# EAGLE design Adafruit HUZZAH32 ESP32 Feather (EAGLE 9.5.0)
COMPANY: ADAFRUIT INDUSTRIES; DRAWN: KTOWN; REV: B
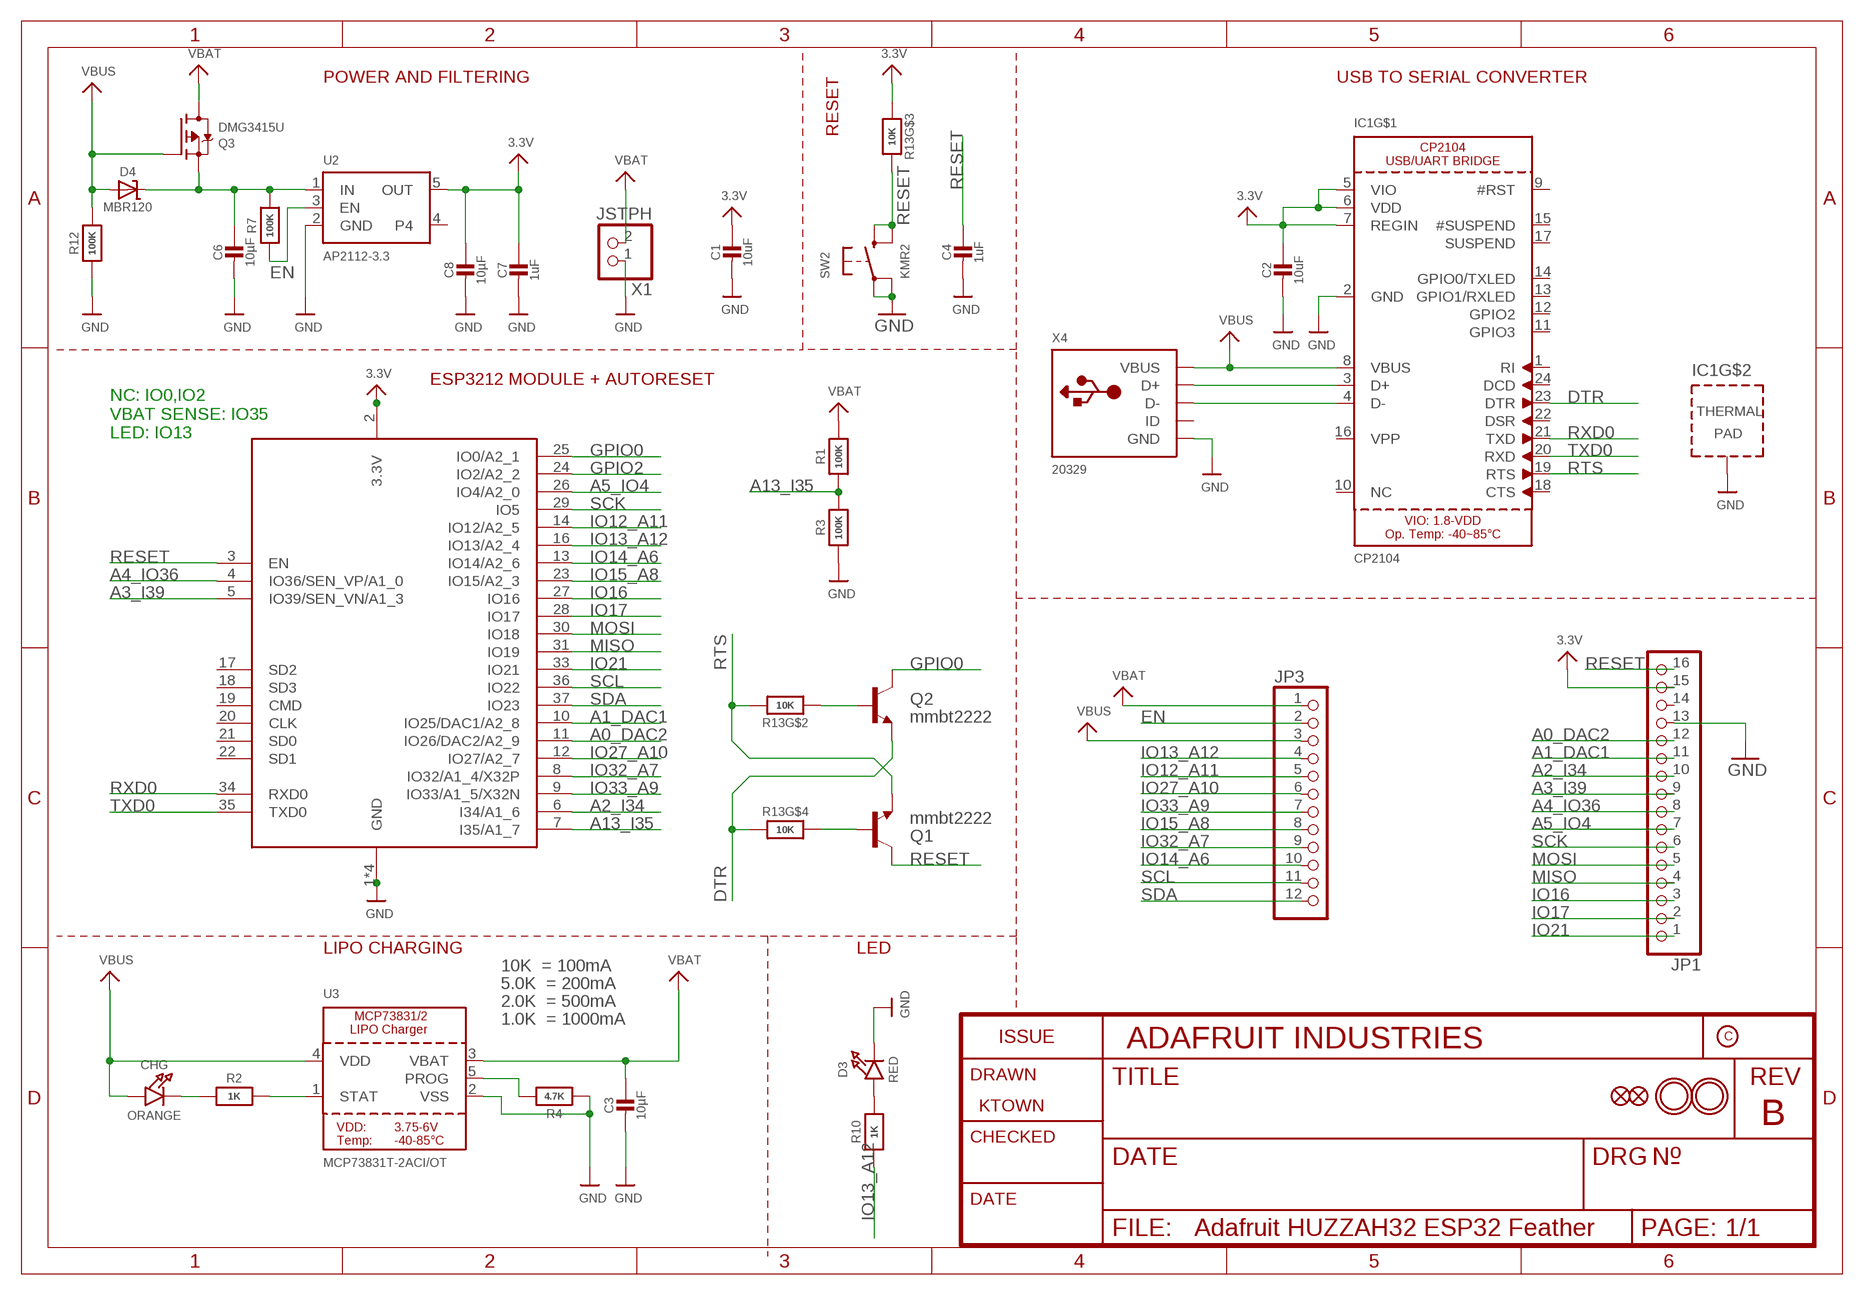
[diagram p0: schematic, sheet 1]

## Parts
C1  10uF  CAP_CERAMIC0805-NOOUTLINE  [0805-NO]
C2  10uF  CAP_CERAMIC0805-NOOUTLINE  [0805-NO]
C3  10µF  CAP_CERAMIC0805-NOOUTLINE  [0805-NO]
C4  1uF  CAP_CERAMIC0603_NO  [0603-NO]
C6  10µF  CAP_CERAMIC0805-NOOUTLINE  [0805-NO]
C7  1uF  CAP_CERAMIC0603_NO  [0603-NO]
C8  10µF  CAP_CERAMIC0805-NOOUTLINE  [0805-NO]
CHG  ORANGE  LED0805_NOOUTLINE  [CHIPLED_0805_NOOUTLINE]
D3  RED  LED0805_NOOUTLINE  [CHIPLED_0805_NOOUTLINE]
D4  MBR120  DIODE-SCHOTTKYSOD-123  [SOD-123]
IC1  CP2104  [QFN24_4MM_SMSC]
JP1  HEADER-1X16_MIN  [1X16_ROUND_MIN]
JP3  HEADER-1X12_MIN  [1X12_ROUND_MIN]
Q1  mmbt2222  TRANSISTOR_NPNSOT23-3  [SOT23-3]
Q2  mmbt2222  TRANSISTOR_NPNSOT23-3  [SOT23-3]
Q3  DMG3415U  MOSFET-P  [SOT23-R]
R1  100K  RESISTOR_0603_NOOUT  [0603-NO]
R2  1K  RESISTOR_0603_NOOUT  [0603-NO]
R3  100K  RESISTOR_0603_NOOUT  [0603-NO]
R4  4.7K  RESISTOR_0603_NOOUT  [0603-NO]
R7  100K  RESISTOR_0603_NOOUT  [0603-NO]
R10  1K  RESISTOR_0603_NOOUT  [0603-NO]
R12  100K  RESISTOR_0603_NOOUT  [0603-NO]
R13  10K  RESISTOR_4PACK  [RESPACK_4X0603]
SW2  KMR2  SWITCH_TACT_SMT4.6X2.8  [BTN_KMR2_4.6X2.8]
U2  AP2112-3.3  VREG_SOT23-5  [SOT23-5]
U3  MCP73831T-2ACI/OT  MCP73831/2  [SOT23-5]
U$31  MOUNTINGHOLE2.5  [MOUNTINGHOLE_2.5_PLATED]
U$32  MOUNTINGHOLE2.5  [MOUNTINGHOLE_2.5_PLATED]
U$34  FIDUCIAL_1MM  [FIDUCIAL_1MM]
U$35  FIDUCIAL_1MM  [FIDUCIAL_1MM]
X1  JSTPH  CON_JST_PH_2PIN  [JSTPH2]
X2  ESP32_WROOM32_SKINNY  [WROOM32_SKINNY]
X4  20329  USB_MICRO_20329_V2  [4UCONN_20329_V2]

## Nets
3.3V: C1.1 C2.1 C7.1 C8.1 IC1.5(VIO) IC1.6(VDD) IC1.7(REGIN) JP1.15 R13.3 U2.5(OUT) X2.2(3.3V)
A0_DAC2: JP1.12 X2.11(IO26/DAC2/A2_9)
A1_DAC1: JP1.11 X2.10(IO25/DAC1/A2_8)
A2_I34: JP1.10 X2.6(I34/A1_6)
A3_I39: JP1.9 X2.5(IO39/SEN_VN/A1_3)
A4_IO36: JP1.8 X2.4(IO36/SEN_VP/A1_0)
A5_IO4: JP1.7 X2.26(IO4/A2_0)
A13_I35: R1.1 R3.2 X2.7(I35/A1_7)
DTR: IC1.23(DTR) Q2.2(E) R13.4
EN: JP3.2 R7.1 U2.3(EN)
GND: C1.2 C2.2 C3.2 C4.2 C6.2 C7.2 C8.2 D3.C IC1.2(GND) IC1.THERM(TP) JP1.13 R3.1 R4.1 R12.1 SW2.A'(P1) SW2.A(P) U2.2(GND) U3.2(VSS) X1.1 X2.1(GND) X2.15(GND) X2.38(GND) X2.P$1(GND) X4.BASE@1(GND) X4.BASE@2(GND) X4.GND X4.SPRT@1(GND) X4.SPRT@2(GND) X4.SPRT@3(GND) X4.SPRT@4(GND)
GPIO0: Q2.3(C) X2.25(IO0/A2_1)
GPIO2: X2.24(IO2/A2_2)
IO12_A11: JP3.5 X2.14(IO12/A2_5)
IO13_A12: JP3.4 R10.1 X2.16(IO13/A2_4)
IO14_A6: JP3.10 X2.13(IO14/A2_6)
IO15_A8: JP3.8 X2.23(IO15/A2_3)
IO16: JP1.3 X2.27(IO16)
IO17: JP1.2 X2.28(IO17)
IO21: JP1.1 X2.33(IO21)
IO27_A10: JP3.6 X2.12(IO27/A2_7)
IO32_A7: JP3.9 X2.8(IO32/A1_4/X32P)
IO33_A9: JP3.7 X2.9(IO33/A1_5/X32N)
MISO: JP1.4 X2.31(IO19)
MOSI: JP1.5 X2.30(IO18)
N$1: CHG.C R2.1
N$2: IC1.3(D+) X4.D+
N$3: R2.2 U3.1(STAT)
N$4: R4.2 U3.5(PROG)
N$5: D3.A R10.2
N$6: IC1.4(D-) X4.D-
N$7: C6.1 D4.C Q3.2(S) R7.2 U2.1(IN)
N$12: Q1.1(B) R13.5
N$13: Q2.1(B) R13.2
RESET: C4.1 JP1.16 Q1.3(C) R13.6 SW2.B'(S1) SW2.B(S) X2.3(EN)
RTS: IC1.19(RTS) Q1.2(E) R13.7
RXD0: IC1.21(TXD) X2.34(RXD0)
SCK: JP1.6 X2.29(IO5)
SCL: JP3.11 X2.36(IO22)
SDA: JP3.12 X2.37(IO23)
TXD0: IC1.20(RXD) X2.35(TXD0)
VBAT: C3.1 JP3.1 Q3.3(D) R1.2 U3.3(VBAT) X1.2
VBUS: CHG.A D4.A IC1.8(VBUS) JP3.3 Q3.1(G) R12.2 U3.4(VDD) X4.VBUS
Unconnected: IC1.1(RI) IC1.9(#RST) IC1.10(NC) IC1.11(GPIO3) IC1.12(GPIO2) IC1.13(GPIO1/RXLED) IC1.14(GPIO0/TXLED) IC1.15(#SUSPEND) IC1.16(VPP) IC1.17(SUSPEND) IC1.18(CTS) IC1.22(DSR) IC1.24(DCD) JP1.14 R13.1 R13.8 U2.4 X2.17(SD2) X2.18(SD3) X2.19(CMD) X2.20(CLK) X2.21(SD0) X2.22(SD1) X4.ID

## Notes on the sheet
- POWER AND FILTERING | USB TO SERIAL CONVERTER
- RESET
- ESP3212 MODULE + AUTORESET
- NC: IO0,IO2
  VBAT SENSE: IO35
  LED: IO13
- LIPO CHARGING | LED
- 10K  = 100mA
- 5.0K  = 200mA
- 2.0K  = 500mA
- 1.0K  = 1000mA

## Library data of the parts
C1-C4 C6-C8 = microbuilder:CAP_CERAMIC: Ceramic Capacitors For new designs, use the packages preceded by an '_' character since they are more reliable: The following footprints should be used on most boards: _0402 - Standard footprint for regular board layouts _0603 - Standard footprint for regular board layouts _0805 - Standard footprint for regular board layouts _1206 - Standard footprint for regular board layouts For extremely tight-pitch boards where space is at a premium, the following 'micro-pitch' footprints can be used (smaller pads, no silkscreen outline, etc.): _0402MP - Micro-pitch footprint for very dense/compact boards _0603MP - Micro-pitch footprint for very dense/compact boards _0805MP - Micro-pitch footprint for very dense/compact boards _1206MP - Micro-pitch footprint for very dense/compact boards
CHG D3 = microbuilder:LED: LED 0603 - 0603 Surface Mount Package 2mA: Green LED - Low Power (3.9mcd, 2ma, 1.7Vf) - Digikey: 475-2709-2-ND Orange LED - Low Power (9.8mcd, 2ma, 1.8Vf) - Digikey: 475-1194-2-ND Red LED - Low Power (5mcd, 2ma, 1.8Vf) - Digikey: 475-1195-2-ND Yellow LED - Low Power (7mcd, 2ma, 1.8Vf) - Digikey: 475-1196-2-ND 5mA: Blue LED - Low Power (17mcd, 5ma, 2.9Vf) - Digikey: LNJ937W8CRACT-ND 0805 - 0805 Surface Mount Package 2mA: Red LED (8.8mcd, 2mA, 1.8Vf, Clear) - Low Power [Digikey: 475-2510-1-ND] Green LED (5mcd, 2mA, 1.8Vf, Clear) - Low Power [Digikey: 475-2730-1-ND] Yellow LED (11.3mcd, 2mA, 1.8Vf, Clear) - Low Power [Digikey: 475-2555-1-ND] 20mA: Red LED (104mcd, 20mA, Diffused) - LS R976 [Digikey: 475-1278-6-ND] Red LED (12mcd, 20mA, 2.0Vf, Clear) - APT2012EC [Digikey: 754-1128-1-ND] Green LED (15mcd, 20mA, 2.2Vf, Clear) - APT2012GC [Digikey: 754-1131-1-ND] Orange LED (160mcd, 20mA, 2.1Vf, Clear) - APT2012SECK [Digikey: 754-1130-1-ND] 1206 - 1206 Surface Mount Package Green LED (26mcd, 20mA, Diffused) - LG N971 [Digikey: 475-1407-6-ND] Red LED (15mcd, 20mA, Diffused) - LH N974 [Digikey: 475-1416-6-ND] Cree - Cree High-Power Surface Mount LEDs XPEBWT-L1-0000-00D50 - White 111lm 350mA 2.9Vf 6200K 110° XTEAWT-00-0000-00000LEE3 - White 114lm 350mA 2.85Vf 5000K 115° Everlight - Everlight 45-21 Series Surface Mount LEDs 45-21/QK2C-B2832AC2CB2/2T - Warm White 2000mcd 20mA 3.25Vf 3050K 120° 45-21/LK2C-B38452C4CB2/2T - Nuetral White 2000mcd 20mA 3.25Vf 4150K 120° 45-21/LK2C-B50634C6CB2/2T - Cold White 2200mcd 20mA 3.25Vf 5650K 120° PLCC2 Reverse Mount LS T77K-J1L2-1-0-2-R18-Z - Red 11.25mcd 2mA 1.8Vf 630nm 120° LO T77K-L1M2-24-Z - Orange 19.6mcd 2mA 1.8Vf 606nm 120° LY T77K-K2M1-26-Z - Yellow 15.7mcd 2mA 1.8Vf 587nm 120°
D4 = microbuilder:DIODE-SCHOTTKY
IC1 = microbuilder:CP2104: CP2104 - USB to UART Bridge VDD Output: 3.45V
JP1 = microbuilder:HEADER-1X16: PIN HEADER
JP3 = microbuilder:HEADER-1X12
Q1 Q2 = SparkFun:TRANSISTOR_NPN: Transistor NPN BJT configuration in SOT23 package. MMBT2222 is the common NPN we use. Double check BCE configuration again layout.
Q3 = microbuilder:MOSFET-P: P-Channel Mosfet LEGEND VDS: Voltage Drain-Source ID: Drain Current RDS(ON): Drain-Source On-State Resistance VGS(TH): Gate-Source Threshold Voltage CISS: Drain-Source Input Capacitance SOT-23 Name VDS ID RDS(ON) VGS(TH) CISS Order Number IRLML5103 30V 760mA 600 mOhm -- 75pF @ 25V Digikey: IRLML5103PBFCT-ND IRLML6401 12V 4.3A 50 mOhm 950mV @ 250µA 830pF @ 10V Digikey: IRLML6401PBFTR-ND NTR0202PL 20V 400mA 800 mOhm 2.3V @ 250uA 70pF @ 5V Digikey: NTR0202PLT1GOSTR-ND NTR4101PT1G 20V 1.8A 85 mOhm 1.2V @ 250uA 675pF @ 10V Digikey: NTR4101PT1GOSCT-ND DMP2004K 20V 600mA 900 mOhm 1V @ 250uA 175pF @ 16V Digikey: DMP2004KDICT-ND PMV65XP 20V 3.9A 76 mOhm 950mV @ 1mA 725pF @ 20V Digikey: 568-2358-2-ND TO-252 Name VDS ID RDS(ON) VGS(TH) CISS Order Number AOD417 30V 25A 34 mOhm 3V @ 250µA 920pF @ 15V Digikey: 785-1106-2-ND PowerPak Name VDS ID RDS(ON) VGS(TH) CISS Order Number AON7401 30V 12A 14 mOhm 3V @ 250µA 2600pF @ 15V Digikey: 785-1302-1-ND
R1-R4 R7 R10 R12 = microbuilder:RESISTOR: Resistors For new designs, use the packages preceded by an '_' character since they are more reliable: The following footprints should be used on most boards: _0402 - Standard footprint for regular board layouts _0603 - Standard footprint for regular board layouts _0805 - Standard footprint for regular board layouts _1206 - Standard footprint for regular board layouts For extremely tight-pitch boards where space is at a premium, the following 'micro-pitch' footprints can be used (smaller pads, no silkscreen outline, etc.): _0402MP - Micro-pitch footprint for very dense/compact boards _0603MP - Micro-pitch footprint for very dense/compact boards _0805MP - Micro-pitch footprint for very dense/compact boards _1206MP - Micro-pitch footprint for very dense/compact boards
R13 = microbuilder:RESISTOR_4PACK: Resistor Packs (4 resistors) 4 x 0603 10K 1/16W - Digikey: YC164J-10KCT-ND
SW2 = microbuilder:SWITCH_TACT_SMT: SMT Tact Switches 6x6mm - Digikey: P12940SCT-ND KMR2 (4.6x2.8mm) - Digikey: 401-1426-1-ND EVQ-PQHB55 - Light Touch, 160GF (4.5x4.5mm) - Digikey: P8090SCT-ND KMT0 - KMT021 NGJ LHS (etc.) IP68/Waterproof - Digikey: CKN10289CT-ND
U2 = microbuilder:VREG_SOT23-5: SOT23-5 Fixed Voltage Regulators Part Current Out V Out V In V Dropout θJA (°C/W) TJ (°C) Digikey Part No. ADP121 150mA 3.3V 3.4-5.5V 0.09V @ 150mA -- -- ADP121-AUJZ33R7CT-ND ADP121 150mA 3.0V 3.1-5.5V 0.09V @ 150mA -- -- ADP121-AUJZ30R7CT-ND ADP122 300mA 3.3V 3.4-5.5V 0.085V @ 300mA -- -- ADP122AUJZ-3.3-R7CT-ND ADP1712 300mA 3.3V 3.5-5.5V 0.17V @ 300mA -- -- ADP1712AUJZ-3.3-R7TR-ND AP7311 (Low Cost) 150mA 3.3V 3.5-6V 0.15V @ 150mA -- -- AP7311-33WG-7DICT-ND LD39015M18R 150mA 1.8V 1.9V-5.5V 0.08V @ 100mA -- -- 497-6977-1-ND LP2985A-33DBVR 150mA 3.3V 3.3-16V 0.28V @ 150mA 206 150 296-18479-1-ND MCP1824T-3302E/OT 300mA 3.3V 3.5V-6V 0.2V @ 300mA -- -- MCP1824T-3302E/OTCT-ND MIC5205-2.5YM5 TR 150mA 2.5V 2.7-16V 0.165V @ 150mA -- -- 576-1257-2-ND MIC5205-3.0YM5 TR 150mA 3.0V 3.2V-16V 0.165V @ 150mA -- -- 576-1258-2-ND MIC5205-3.3YM5 TR 150mA 3.3V 3.5V-16V 0.165V @ 150mA -- -- 576-1259-2-ND TPS780330220 150mA 3.3V+2.2V 3.6-5.5V 250mV Max -- -- 296-23332-1-ND TDA3663/N1,135 100mA 3.3V 3.5-45V 0.18V @ 50mA -- -- 568-5343-1-ND Max operating temp can be calculated using θJA, TJ (max junction temperature), and power in watts. Set the "Maximum Ambient Temperature" until it reaches TJ ("Max Junction Temperature"), which is the absolute limit for safe use of the regulator: Heat Sink Temperature Calculator <http://www.daycounter.com/Calculators/Heat-Sink-Temperature-Calculator.phtml> For example, With 12V source into a 3.3V LP2985 and a 30mA load, we are dissipating (12V-3.3V) * 0.03A = 0.261W. With a θJA of 206 °C/W, a TJ of 150°C, and 261mW we can safely use the chip without a heat sink up to 75°C (=147.1°C Junction Temperature).
U3 = microbuilder:MCP73831/2: MCP73831/2 LIPO Charger VDD: 3.75 - 6V Temp -40 - 85°C Programmable Charge Rate: 15-500mA NOTE: STAT is a tri-state logic output on the MCP73831 and an open-drain output on the MCP73832. SOT23-5 with 4.2V output and tri-state logic on STAT = MCP73831T-2ACI/OT
U$31 U$32 = microbuilder:MOUNTINGHOLE: Mounting Hole For #2 screws (0.086"/2.18mm width, 0.094"/2.4mm hole) use 2.5mm; BOM: EXCLUDE
U$34 U$35 = microbuilder:FIDUCIAL: Fiducial Alignment Points Various fiducial points for machine vision alignment.; BOM: EXCLUDE
X1 = microbuilder:CON_JST_PH_2PIN: JST 2-Pin Right-Angle Connector PH-Series - 4UConnector: 17311 SH-Series - 4UConnector: 07278
X2 = microbuilder:ESP32_WROOM32
X4 = microbuilder:USB: USB Connectors USBMINIB - Surface Mount Female Mini-B USB Connector 4UConnector: 06564

## Board
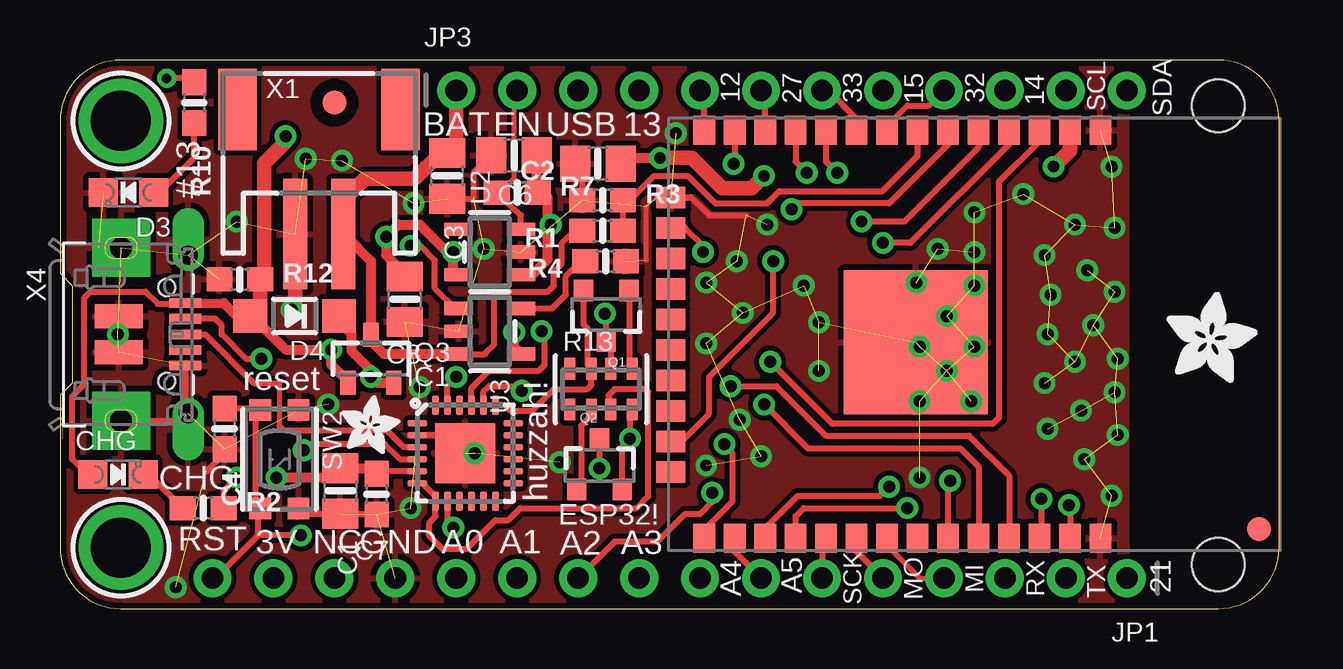
[diagram p1: board, top side]
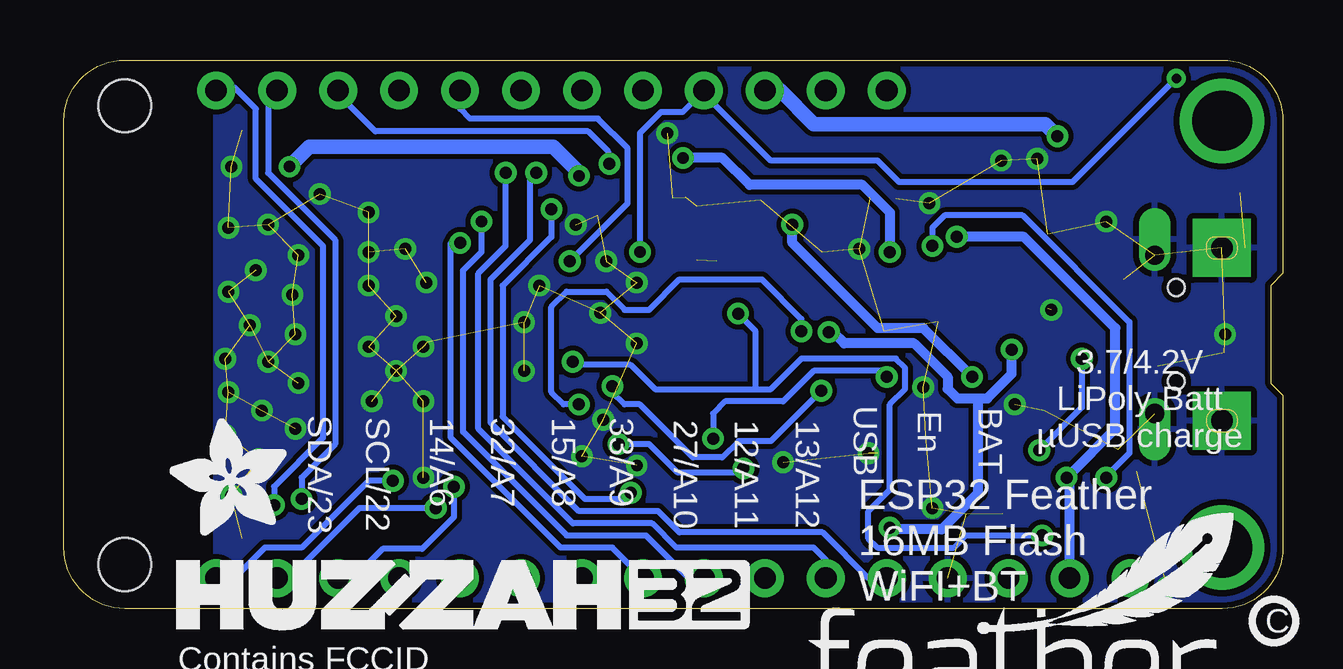
[diagram p2: board, bottom side, seen from below]

Size 50.8 x 22.86 mm. Coordinates in mm from the lower left corner, seen from the top.
Outline: 2.54,0 48.26,0 arc90 50.8,2.54 50.8,20.32 arc90 48.26,22.86 2.54,22.86 arc90 0,20.32 0,13.97 0.51,13.46 0.51,9.4 0,8.89 0,2.54 arc90 2.54,0
Copper layers (1*16): Top 0.035mm / dielectric 1.5mm / Bottom 0.035mm
Design rules "adafruit 7-7 *": minimum track width 6mil, minimum drill 15.5mil, track to track 8mil, track to pad 7mil, pad to pad 7mil, via to via 7mil, smd to smd 7mil, copper to edge 10mil, drill to drill 8mil, minimum pad ring 10mil, minimum via ring 8mil, stop-mask expansion 2mil, vias tented up to drill 20mil, thermal gap 10mil
Holes 2.2 mm at 48.26,1.84 48.26,20.95

### Footprints (pad centres in the part's own frame; a part is rotated, then mirrored left to right if it is on the bottom)
0805-NO = smd 1.24 x 1.5: 1 -0.95,0; 2 0.95,0
0603-NO = smd 1.075 x 1: 1 -0.85,0; 2 0.85,0
CHIPLED_0805_NOOUTLINE = smd 1.2 x 1.2: A 0,-1.05; C 0,1.05
SOD-123 = smd 1.4 x 1.4: A 1.85,0; C -1.85,0
QFN24_4MM_SMSC = smd 0.8 x 0.28: 1 -2,1.25; 2 -2,0.75; 3 -2,0.25; 4 -2,-0.25; 5 -2,-0.75; 6 -2,-1.25; 13 2,-1.25; 14 2,-0.75; 15 2,-0.25; 16 2,0.25; 17 2,0.75; 18 2,1.25 | smd 0.28 x 0.8: 7 -1.25,-2; 8 -0.75,-2; 9 -0.25,-2; 10 0.25,-2; 11 0.75,-2; 12 1.25,-2; 19 1.25,2; 20 0.75,2; 21 0.25,2; 22 -0.25,2; 23 -0.75,2; 24 -1.25,2 | smd 2.5 x 2.5: THERM 0,0
1X16_ROUND_MIN = drill 0.9 pad 1.575: 1 -19.05,0; 2 -16.51,0; 3 -13.97,0; 4 -11.43,0; 5 -8.89,0; 6 -6.35,0; 7 -3.81,0; 8 -1.27,0; 9 1.27,0; 10 3.81,0; 11 6.35,0; 12 8.89,0; 13 11.43,0; 14 13.97,0; 15 16.51,0; 16 19.05,0
1X12_ROUND_MIN = drill 0.9 pad 1.575: 1 -13.97,0; 2 -11.43,0; 3 -8.89,0; 4 -6.35,0; 5 -3.81,0; 6 -1.27,0; 7 1.27,0; 8 3.81,0; 9 6.35,0; 10 8.89,0; 11 11.43,0; 12 13.97,0
SOT23-3 = smd 0.8 x 0.9: 1 -0.95,-1; 2 0.95,-1; 3 0,1.1
SOT23-R = smd 0.635 x 1.016: 1 -0.95,-1; 2 0.95,-1; 3 0,1
RESPACK_4X0603 = smd 0.45 x 0.9: 1 -1.3,-0.85; 2 -0.4,-0.85; 3 0.4,-0.85; 4 1.3,-0.85; 5 1.3,0.85; 6 0.4,0.85; 7 -0.4,0.85; 8 -1.3,0.85
BTN_KMR2_4.6X2.8 = smd 0.9 x 0.9: A 2.05,0.8; A' -2.05,0.8; B 2.05,-0.8; B' -2.05,-0.8
SOT23-5 = smd 0.55 x 1.2: 1 -0.95,-1.3; 2 0,-1.3; 3 0.95,-1.3; 4 0.95,1.3; 5 -0.95,1.3
MOUNTINGHOLE_2.5_PLATED = drill 2.5 pad 3.2: P$1 0,0
FIDUCIAL_1MM = smd 1 x 1: 1 0,0
JSTPH2 = smd 1 x 4.6: 1 -1,-3.7; 2 1,-3.7 | smd 1.6 x 3.4: NC1 -3.4,1.5; NC2 3.4,1.5
WROOM32_SKINNY = smd 1.2 x 0.9: 1 -8.5,5; 2 -8.5,3.73; 3 -8.5,2.46; 4 -8.5,1.19; 5 -8.5,-0.08; 6 -8.5,-1.35; 7 -8.5,-2.62; 8 -8.5,-3.89; 9 -8.5,-5.16; 10 -8.5,-6.43; 11 -8.5,-7.7; 12 -8.5,-8.97; 13 -8.5,-10.24; 14 -8.5,-11.51; 25 8.5,-11.51; 26 8.5,-10.24; 27 8.5,-8.97; 28 8.5,-7.7; 29 8.5,-6.43; 30 8.5,-5.16; 31 8.5,-3.89; 32 8.5,-2.62; 33 8.5,-1.35; 34 8.5,-0.08; 35 8.5,1.19; 36 8.5,2.46; 37 8.5,3.73; 38 8.5,5 | smd 0.9 x 1.2: 15 -5.7,-12.9; 16 -4.43,-12.9; 17 -3.16,-12.9; 18 -1.89,-12.9; 19 -0.62,-12.9; 20 0.65,-12.9; 21 1.92,-12.9; 22 3.19,-12.9; 23 4.46,-12.9; 24 5.73,-12.9 | smd 6 x 6: P$1 0.34,-2.7
4UCONN_20329_V2 = smd 1 x 2: BASE@1 -0.75,-2; BASE@2 0.75,-2 | smd 0.4 x 1.35: D+ 0,0.775; D- -0.65,0.775; GND 1.3,0.775; ID 0.65,0.775; VBUS -1.3,0.775 | drill 0.8 pad 1.143 offset: SPRT@1 -3.3,0.9; SPRT@2 3.3,0.9 | drill 0.9 pad 2.413 square: SPRT@3 -3.6,-1.9; SPRT@4 3.6,-1.9 | hole 0.7: -1.95,0; 1.95,0

### Placement (x,y rotation side)
C1  11.68,4.9 270 top
C2  22.42,18.54 180 top
C3  16.13,18.03 270 top
C4  6.86,7.49 270 top
C6  18.92,18.88 180 top
C7  13.19,4.78 270 top
C8  14.37,12.89 270 top
CHG  2.41,5.59 270 top
D3  2.86,17.34 90 top
D4  9.78,12.19 180 top
IC1  16.89,6.48 0 top
JP1  25.4,1.27 180 top
JP3  30.48,21.59 0 top
Q1  22.76,12.26 180 top
Q2  22.48,5.97 0 top
Q3  12.95,10.41 0 top
R1  22.61,15.75 180 top
R2  5.97,4.19 0 top
R3  22.61,17.02 0 top
R4  22.73,14.48 180 top
R7  19.05,17.34 0 top
R10  5.59,21.08 270 top
R12  7.49,13.72 0 top
R13  22.54,9.14 0 top
SW2  9.14,6.22 270 top
U2  17.91,14.86 90 top
U3  17.91,11.56 270 top
U$7  [ADAFRUIT_5MM]  41.53,3.05 90 bottom
U$9  [FEATHERLOGO_MED]  19.88,-4.25 0 bottom  (outside the outline)
U$13  [PCBFEAT-REV-040]  0.38,-0.51 0 bottom
U$14  [ADAFRUIT_2.5MM]  11.73,6.45 0 top
U$15  [ADAFRUIT_3.5MM]  46.1,9.4 0 top
U$31  2.54,20.32 270 top
U$32  2.54,2.54 270 top
U$34  11.43,21.08 270 top
U$35  49.96,3.31 270 top
U$43  [HUZZAH32]  46.1,-0.89 0 bottom
X1  10.79,19.3 0 top
X2  38.35,11.43 270 top
X4  4.45,11.43 270 top

### Tracks (layer width: path | path; a pad name or v marks a point on that pad's centre or on a via)
3.3V  (via drill 0.48, 0.5)
  Top 0.254: C7.1 12.8,5.62 | 13.26,5.73 IC1.5 IC1.6 15.09,5.23 15.64,4.68 IC1.7 15.64,3.83 15.37,3.56 15.37,3.05 15.93,2.49 16.94,2.49 18.14,3.68 18.67,3.68 19.18,4.19 24,4.19 24.51,4.7 24.51,9.02 24.38,9.14 23.11,9.14 22.86,8.89 22.86,8.38 R13.3 22.99,8.34
  Top 0.406: U2.5 16.38,14.13 v16.38,14.86 16.13,14.86 14.99,16 14.1,16 v13.59,15.49 13.59,14.73 14.37,13.96 C8.1 | 12.91,5.9 C7.1 | 13.26,5.73 13.26,5.69 C7.1 | v9.02,5.46 11.29,5.46 C1.1 12.96,5.85 C7.1 | C2.1 23.61,18.78 v24.99,18.78
  Top 0.61: X2.2 42.08,19.1 v41.4,18.42 | v29.34,18.03 28.83,17.53 27.58,17.53 26.33,18.78 v24.99,18.78
  Bottom 0.406: 8.89,5.59 6.98,7.49 6.98,11.68 10.8,15.49 v13.59,15.49 | JP1.15 8.89,5.59 | v16.38,14.86 16.38,16.51 17.53,17.65 22.23,17.65 23.36,18.78 v24.99,18.78 | 29.46,18.16 v29.34,18.03 | 8.89,5.59 v9.02,5.46
  Bottom 0.61: v29.34,18.03 29.34,18.19 30.4,19.25 40.56,19.25 v41.4,18.42
A0_DAC2  (via drill 0.5)
  Top 0.254: X2.11 30.65,18.62 v31.12,18.16
  Bottom 0.254: JP1.12 17.27,1.27 19.18,3.17 25.15,3.17 26.04,4.06 29.34,4.06 33.02,7.75 33.02,13.72 31.37,15.37 31.37,17.93 31.34,17.93 v31.12,18.16
A1_DAC1  (via drill 0.5)
  Top 0.254: X2.10 31.92,18.61 31.94,18.61 v32.38,18.16
  Bottom 0.254: JP1.11 19.05,2.03 19.56,2.54 25.27,2.54 26.29,3.56 29.59,3.56 33.53,7.49 33.53,13.97 32.38,15.11 v32.38,18.16
A2_I34  (via drill 0.5)
  Top 0.254: X2.6 37,19.35 34.54,16.89 30.73,16.89 v30.48,16.64 | v27.18,4.83 27.18,4.44 26.67,3.94 26.04,3.94 24.89,2.79 23.11,2.79 JP1.10
  Bottom 0.254: v30.48,16.64 30.48,15.49 32.51,13.46 32.51,8 29.08,4.57 27.43,4.57 v27.18,4.83
A3_I39  (via drill 0.48)
  Top 0.254: X2.5 38.27,19.22 35.18,16.13 v33.4,16.13 33.53,16.26 33.53,16.13
  Bottom 0.254: v33.4,16.13 33.4,14.86 34.16,14.1 34.16,7.37 29.84,3.05 26.54,3.05 24.77,1.27 JP1.9
A4_IO36  (via drill 0.5)
  Top 0.254: X2.4 39.54,19.35 35.43,15.24 v34.29,15.24
  Bottom 0.254: v34.29,15.24 34.67,15.24 34.67,7.11 30.1,2.54 27.94,2.54 JP1.8
A5_IO4
  Top 0.254: X2.26 28.11,2.37 JP1.7
A13_I35
  Top 0.254: X2.7 35.73,18.87 34.26,17.4 29.97,17.4 29.46,16.89 27.3,16.89 26.16,18.03 24.77,18.03 23.75,17.02 R3.2 R1.1
DTR  (via drill 0.5)
  Top 0.254: R13.4 23.75,8.2 v23.75,7.09 23.43,6.77 Q2.2 | IC1.23 16.14,9.28 v16.51,9.65
  Bottom 0.254: v16.51,9.65 16.76,9.91 19.56,9.91 20.83,8.64 23.24,8.64 23.75,8.13 v23.75,7.09
EN
  Top 0.203: 18.92,17.91 18.92,20.96
  Top 0.254: 18.92,20.96 19.05,21.08 JP3.2 | 18.92,17.91 18.45,17.44 18.24,17.44 R7.1 19.21,16.39 U2.3
GND  (via drill 0.48, 0.5)  (82 unrouted)
  Top 0.203: 24.43,14.52 24.43,16.76
  Top 0.254: 1.59,15.03 X4.SPRT@3 | X4.GND 5.22,8.26 X4.SPRT@2 5.05,7.83 X4.SPRT@4 | IC1.2 16.89,7.23 16.89,6.73 17.02,6.73 v17.27,6.48 | 24.89,17.14 26.29,17.14 27.05,16.38 28.58,16.38 | C7.2 10.19,3.92 SW2.A | C3.2 17.21,17.08 | 17.25,17.14 17.25,18.19 17.94,18.88 C6.2 | C4.2 6.86,6.48 6.1,5.71 | C2.2 21.76,18.25 R3.1
  Top 0.61: 9.8,12.5 X1.1
  other vias: 2.41,11.43 11.75,18.67 11.18,8.51 4.83,0.89 7.37,16.13 10.24,18.75 14.61,4.19 35.81,8.64 17.65,14.99 31.62,9.91 38.1,13.46 35.69,13.59 37.97,8.64 28.19,14.48 44.07,7.24 43.94,9.02 44.07,10.41 43.94,13.21 43.94,15.87 43.81,18.41 42.29,16 38.1,14.86 36.58,14.99 41.15,7.49 42.67,6.22 43.81,4.7 42.55,8.26 41.02,9.4 42.29,10.29 41.15,11.43 43.05,11.81 41.27,13.08 42.8,14.1 36.96,12.19 36.96,9.91 41.02,14.73 40.13,17.27 28.32,7.87 28.45,12.32 9.65,12.45 14.73,16.89 14.99,9.22 26.92,5.97 26.92,13.59 25.65,19.81 35.81,10.92 38.1,10.92 20.83,6.1 38.1,16.51 35.81,5.46 29.46,16 30.99,13.46 31.62,11.94 29.21,6.35 26.92,11.05
  pour Top: 0,22.86 0,0 44.45,0 44.45,22.86
  pour Bottom: 0,0 44.45,0 44.45,22.86 0,22.86
GPIO0  (via drill 0.5)
  Top 0.254: v27.69,6.86 27.69,6.79 28,6.48 28,4.44 26.84,3.29 X2.25 | Q2.3 v22.48,5.84
  Bottom 0.254: v27.69,6.86 26.42,6.86 25.25,5.69 22.63,5.69 v22.48,5.84
IO12_A11
  Top 0.254: X2.14 26.84,21.42 JP3.5
IO13_A12  (via drill 0.39, 0.48)
  Top 0.254: R10.1 5.42,22.1 v4.45,22.1 | 25.64,15.86 X2.16 25.47,15.87 26.04,15.87 26.8,15.11 v26.8,14.86
  Bottom 0.254: v4.45,22.1 8.76,17.78 16,17.78 16.89,18.67 21.34,18.67 24.13,21.46 JP3.4 25.02,20.7 25.91,20.7 26.8,19.81 v26.8,14.86
IO14_A6  (via drill 0.5)
  Top 0.254: X2.13 28.11,18.59 v28.07,18.54
  Bottom 0.254: v28.07,18.54 28.11,18.59 28.11,19.05 28.95,19.89 37.82,19.89 39.37,21.44 JP3.10
IO15_A8  (via drill 0.5)
  Top 0.254: 25.34,6.86 X2.23 25.47,6.99 25.91,6.99 27.05,8.13 27.05,9.65 29.72,12.32 v29.72,14.48
  Bottom 0.254: v29.72,14.48 27.3,16.89 27.3,19.18 28.55,20.42 33.88,20.42 34.29,20.83 JP3.8
IO16  (via drill 0.5)
  Top 0.254: X2.27 29.38,3.35 30.73,4.7 34.16,4.7 v34.54,5.08
  Bottom 0.254: v34.54,5.08 34.54,3.81 35.86,2.49 37.52,2.49 38.73,1.27 JP1.3
IO17  (via drill 0.5)
  Top 0.254: X2.28 30.65,3.86 30.99,4.19 v35.31,4.19
  Bottom 0.254: v35.31,4.19 38.48,4.19 41.15,1.52 41.66,1.52 JP1.2
IO21  (via drill 0.5)
  Top 0.254: X2.33 37,5.25 v37.08,5.33
  Bottom 0.254: v37.08,5.33 38.1,5.33 40.89,2.54 42.42,2.54 43.69,1.27 JP1.1
IO27_A10
  Top 0.254: X2.12 29.38,21.42 JP3.6
IO32_A7
  Top 0.203: 34.46,20.24 34.54,20.32 34.67,20.32 35.31,20.96
  Top 0.254: X2.8 34.46,20.24 | 35.31,20.96 36.2,20.96 JP3.9
IO33_A9
  Top 0.254: X2.9 33.19,20.4 32,21.59 JP3.7
MISO
  Top 0.203: X2.31 34.46,2.62 35.81,1.27 JP1.4
MOSI
  Top 0.254: X2.30 33.19,2.37 JP1.5
N$1
  Top 0.254: CHG.C 3.72,5.59 R2.1
N$2
  Top 0.203: 9.14,9.4 9.14,7.62
  Top 0.254: IC1.3 14.33,6.73 13.61,7.44 9.32,7.44 9.14,7.62 | X4.D+ 6.05,11.43 8.08,9.4 9.14,9.4
N$3  (via drill 0.5)
  Top 0.254: v14.61,15.11 15.01,15.11 15.62,14.5 15.62,13.33 16.45,12.51 U3.1 | R2.2 6.82,4.91 v7.37,5.46
  Bottom 0.254: v14.61,15.11 14.61,15.87 14.1,16.38 10.85,16.38 6.4,11.94 6.4,6.48 7.37,5.51 v7.37,5.46
N$4
  Top 0.254: U3.5 20.51,12.51 21.08,13.08 21.08,13.84 21.72,14.48 R4.2
N$5
  Top 0.254: D3.A 4.13,17.34 5.59,18.8 R10.2
N$6  (via drill 0.5)
  Top 0.254: IC1.4 14.17,6.23 13.54,6.86 10.41,6.86 v10.16,6.6 | X4.D- 6.46,12.08 6.73,11.81 6.73,11.43 7.75,10.41 v8.38,10.41
  Bottom 0.254: v8.38,10.41 8.38,8.38 v10.16,6.6
N$7  (via drill 0.5)
  Top 0.406: 20.32,16 20.32,14.55 19.67,13.91 U2.1 | 20.32,16 20.32,17.14 20.07,17.4 R7.2 19.87,17.43 C6.1 | v12.95,9.65 13.19,9.41 Q3.2 | v20.45,16 20.32,16 | 11.63,11.87 D4.C 11.63,11.97 12.14,11.46 12.14,10.74 12.95,9.93 v12.95,9.65 | 12.95,9.96 v12.95,9.65
  Bottom 0.406: v12.95,9.65 14.99,11.68 16.89,11.68 20.45,15.24 v20.45,16
N$12
  Top 0.254: Q1.1 23.71,10.13 R13.5
N$13
  Top 0.254: 21.24,5.26 Q2.1 21.46,5.03 21.46,5.08 21.72,5.33 21.72,7.62 22.14,8.05 R13.2
RESET  (via drill 0.5)
  Top 0.254: JP1.16 6.48,1.27 8.25,3.05 | v10.03,3.05 8.25,3.05 | X2.3 40.81,19.48 39.12,17.78 39.12,7.95 38.86,7.7 32.18,7.7 v29.59,10.29 | 8.25,3.05 8.25,4.08 SW2.B 8.13,4.39 8.13,8.13 8.2,8.13 SW2.B' 8.27,8.34 C4.1 | v22.71,12.29 22.76,12.24 Q1.3 22.94,10.97 R13.6
  Bottom 0.254: v10.03,3.05 13.21,3.05 13.72,2.54 16.89,2.54 17.27,2.92 17.27,4.06 16.38,4.95 16.38,8.51 15.75,9.14 15.75,10.03 16.13,10.41 20.07,10.41 21.34,9.14 21.97,9.14 | 21.97,9.14 26.16,9.14 27.18,10.16 29.46,10.16 v29.59,10.29 | 21.97,9.14 21.97,11.56 v22.71,12.29
RTS
  Top 0.254: IC1.19 18.52,8.48 18.74,8.26 19.68,8.26 20.57,9.14 21.97,9.14 22.14,9.32 R13.7 21.97,10.17 21.97,11.68 21.81,11.85 Q1.2
RXD0  (via drill 0.5)
  Top 0.254: 29.46,8.51 v29.34,8.51 31.17,6.68 37.52,6.68 38.27,5.92 X2.34 | IC1.21 17.14,9.19 17.86,9.91 19.94,9.91 20.19,10.16 20.19,11.43 v20.07,11.56
  Bottom 0.254: v29.34,8.51 29.97,8.51 30.48,9.02 30.48,12.57 29.84,13.21 28.19,13.21 27.43,12.45 26.42,12.45 25.15,13.72 21.72,13.72 20.07,12.06 v20.07,11.56
SCK
  Top 0.254: X2.29 31.75,2.76 JP1.6
SCL  (via drill 0.5)
  Top 0.254: v40.89,4.57 40.89,3.01 X2.36
  Bottom 0.254: JP3.11 42.29,21.21 42.29,18.16 39.5,15.37 39.5,6.86 40.89,5.46 v40.89,4.57
SDA  (via drill 0.5)
  Top 0.254: v42.04,4.32 42.08,4.27 X2.37
  Bottom 0.254: JP3.12 44.32,21.72 43.69,21.72 42.8,20.83 42.8,17.91 40.01,15.11 40.01,7.11 42.04,5.08 v42.04,4.32
TXD0  (via drill 0.5)
  Top 0.254: IC1.20 17.64,9.03 17.88,9.27 19.05,9.27 v19.24,9.08 | v27.94,9.27 29.84,9.27 31.9,7.21 37.87,7.21 39.54,5.54 X2.35
  Bottom 0.254: v27.94,9.27 27.94,9.02 27.43,8.51 26.8,8.51 24.59,6.3 23.37,6.3 22.68,6.99 21.34,6.99 v19.24,9.08
VBAT
  Top 0.254: 11.68,16.26 11.94,16 | U3.3 17.72,10.61 17.72,10.63 18.08,11 18.08,13.21 20.32,13.21 20.57,13.46 20.57,14.03 20.9,14.36 20.9,15.21 21.44,15.75 R1.2 21.46,15.75
  Top 0.406: X1.2 11.94,15.75 | 11.94,15.75 11.94,16 | 11.68,16.89 11.68,16.26 | 11.94,15.75 11.94,15.49 12.95,14.48 Q3.3 12.95,11.16 13.51,10.61 U3.3 | 15.93,18.8 C3.1
  Top 0.61: 11.68,16.89 12.7,17.91 14.79,17.91 15.86,18.98 C3.1 | C3.1 | C3.1 16.51,19.38 JP3.1
VBUS  (via drill 0.5)
  Top 0.254: CHG.A 1.14,5.59 0.51,6.22 0.51,8.84 1.02,9.35 1.02,12.95 1.27,13.21 3.56,13.21 4.06,12.7 5.19,12.7 X4.VBUS | D4.A 8.34,12.61 | IC1.8 16.14,3.62 v16.38,3.38
  Top 0.381: X4.VBUS 6.83,12.73
  Top 0.406: Q3.1 12,9.46 11.3,10.16 v11.3,10.8 9.4,10.8 8,12.19 D4.A 7.37,12.19 6.83,12.73 | U3.4 18.92,10.89 v18.92,11.53
  Top 0.61: 8.34,12.61 R12.2 8.51,13.88 8.51,18.57 9.4,19.46 v9.4,19.69
  Bottom 0.406: v18.92,11.53 18.77,11.53 18.29,11.05 15.37,11.05 13.97,9.65 13.97,9.14 13.94,9.14 13.56,8.76 12.7,8.76 | 12.7,8.76 12.32,8.76 11.3,9.78 v11.3,10.8 | 12.7,8.76 12.7,4.83 14.22,3.3 16.31,3.3 v16.38,3.38
  Bottom 0.61: JP3.3 20.95,21.59 19.56,20.19 9.91,20.19 v9.4,19.69

### Text on the board
tPlace: SCL | 12 | 27 | 33 | 15 | 32 | 14 | SDA | BAT | EN | USB | 13 | #13 | reset | huzzah! | CHG | ESP32! | RST | 3V | NC | GND | A0 | A1 | A3 | A2 | A4 | A5 | SCK | MO | MI | RX | TX | 21
bPlace: 3.7/4.2V / LiPoly Batt / µUSB charge | BAT | En | USB | 33/A9 | 15/A8 | 32/A7 | 14/A6 | 13/A12 | 12/A11 | 27/A10 | SCL/22 | SDA/23 | ESP32 Feather / 16MB Flash / WiFI+BT | Contains FCCID / 2AC7Z-ESP32 | MOSI/18 | MISO/19 | A1 / DAC1 | A2/34 | A3/39 | A4/36 | SCK/5 | RX/16 | TX/17 | RST | GND | A0 / DAC2 | A5/4 | 3V | NC | 21